# EAGLE schematic cdciom8print (EAGLE 7.7.0)
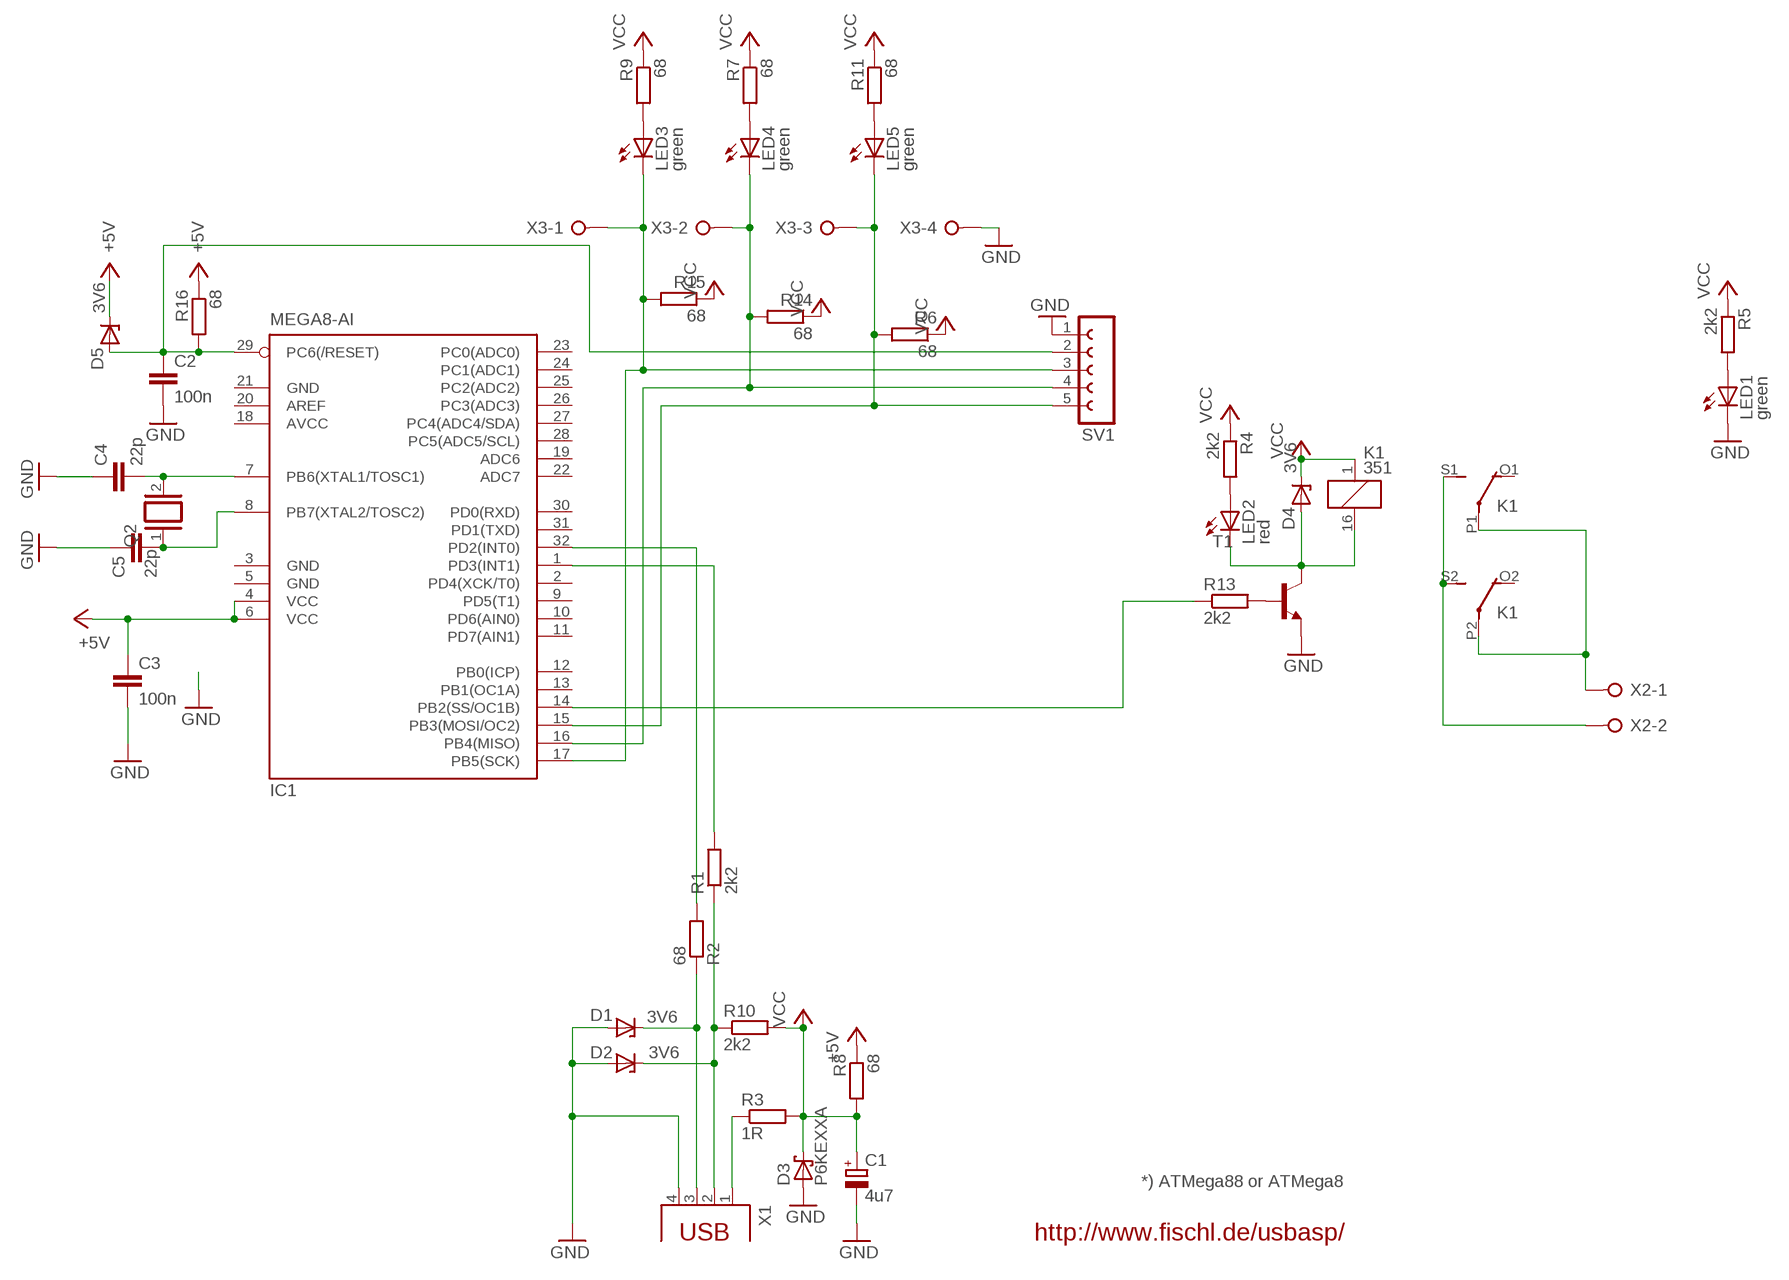
[diagram p0: schematic, sheet 1]

## Parts
C1  4u7  CPOL-EUE2.5-5  [E2,5-5]
C2  100n  C-EU025-024X044  [C025-024X044]
C3  100n  C-EU025-024X044  [C025-024X044]
C4  22p  C-EU025-024X044  [C025-024X044]
C5  22p  C-EU025-024X044  [C025-024X044]
D1  3V6  ZENER-DIODEDO34-7  [DO34Z7]
D2  3V6  ZENER-DIODEDO34-7  [DO34Z7]
D3  P6KEXXA  [C1702-15]
D4  3V6  ZENER-DIODEDO34-7  [DO34Z7]
D5  3V6  ZENER-DIODEDO34-7  [DO34Z7]
IC1  MEGA8-AI  [TQFP32-08]
K1  351  [351]
LED1  green  LED3MM  [LED3MM]
LED2  red  LED3MM  [LED3MM]
LED3  green  LED3MM  [LED3MM]
LED4  green  LED3MM  [LED3MM]
LED5  green  LED3MM  [LED3MM]
Q2  XTAL/S  [QS]
R1  2k2  R-EU_0207/2V  [0207/2V]
R2  68  R-EU_0207/10  [0207/10]
R3  1R  R-EU_0207/2V  [0207/2V]
R4  2k2  R-EU_0207/2V  [0207/2V]
R5  2k2  R-EU_0207/2V  [0207/2V]
R6  68  R-EU_0207/10  [0207/10]
R7  68  R-EU_0207/10  [0207/10]
R8  68  R-EU_0207/10  [0207/10]
R9  68  R-EU_0207/10  [0207/10]
R10  2k2  R-EU_0207/2V  [0207/2V]
R11  68  R-EU_0207/10  [0207/10]
R13  2k2  R-EU_0207/2V  [0207/2V]
R14  68  R-EU_0207/10  [0207/10]
R15  68  R-EU_0207/10  [0207/10]
R16  68  R-EU_0207/10  [0207/10]
SV1  FE05-1  [FE05-1]
T1  2N4124-NPN-TO92-CBE  [TO92-CBE]
X1  PN61729  [PN61729]
X2  W237-02P  [W237-132]
X3  W237-04P  [W237-4P]

## Nets
+5V: C3.1 D5.C IC1.4(VCC) IC1.6(VCC) R8.1 R16.1
GND: C1.- C2.2 C3.2 C4.1 C5.1 D1.A D2.A D3.A LED1.K(C) SV1.1 T1.E X1.4 X3.4
N$1: C2.1 D5.A IC1.29(PC6(/RESET)) R16.2 SV1.2
N$2: R13.2 T1.B
N$3: IC1.14(PB2(SS/OC1B)) R13.1
N$4: D4.A K1.16 LED2.K(C) T1.C
N$5: D2.C R1.1 R10.1 X1.2
N$6: K1.S1(2:S) K1.S2(3:S) X2.2
N$7: IC1.32(PD2(INT0)) R2.2
N$8: D1.C R2.1 X1.3
N$9: LED2.A R4.2
N$10: K1.P1(2:P) K1.P2(3:P) X2.1
N$11: R3.1 X1.1
N$12: LED1.A R5.2
N$13: LED3.A R9.2
N$14: LED4.A R7.2
N$15: LED5.A R11.2
N$16: IC1.1(PD3(INT1)) R1.2
N$17: IC1.17(PB5(SCK)) LED3.K(C) R15.2 SV1.3 X3.1
N$18: IC1.16(PB4(MISO)) LED4.K(C) R14.2 SV1.4 X3.2
N$19: IC1.15(PB3(MOSI/OC2)) LED5.K(C) R6.2 SV1.5 X3.3
N$22: C4.2 IC1.7(PB6(XTAL1/TOSC1)) Q2.2
N$23: C5.2 IC1.8(PB7(XTAL2/TOSC2)) Q2.1
VCC: C1.+ D3.C D4.C K1.1 R3.2 R4.1 R5.1 R6.1 R7.1 R8.2 R9.1 R10.2 R11.1 R14.1 R15.1
Unconnected: IC1.2(PD4(XCK/T0)) IC1.9(PD5(T1)) IC1.10(PD6(AIN0)) IC1.11(PD7(AIN1)) IC1.12(PB0(ICP)) IC1.13(PB1(OC1A)) IC1.19(ADC6) IC1.20(AREF) IC1.22(ADC7) IC1.23(PC0(ADC0)) IC1.24(PC1(ADC1)) IC1.25(PC2(ADC2)) IC1.26(PC3(ADC3)) IC1.27(PC4(ADC4/SDA)) IC1.28(PC5(ADC5/SCL)) IC1.30(PD0(RXD)) IC1.31(PD1(TXD)) K1.O1(2:O) K1.O2(3:O)

## Notes on the sheet
- *) ATMega88 or ATMega8
- http://www.fischl.de/usbasp/

## Power pins joined to a net without a drawn wire
AVCC: IC1.18(AVCC)
GND: IC1.3(GND) IC1.5(GND) IC1.21(GND)

## Library data of the parts
C1 = rcl:CPOL-EU: POLARIZED CAPACITOR, European symbol
C2-C5 = rcl:C-EU: CAPACITOR, European symbol
D1 D2 D4 D5 = diode:ZENER-DIODE: Z-Diode
D3 = diode:P6KEXXA: DIODE transient-voltage suppressor
IC1 = atmel:MEGA8: MICROCONTROLLER 8 Kbytes FLASH, 1 kbytes SRAM, 512 bytes EEPROM, USART, 6-channel 10 bit ADC, 2-channel 8 bit ADC Pin compatible with Atmega48, ATMega88, ATMega168 Source: avr.lbr; MPN: ATMEGA8-16AU; OC_FARNELL: 9171371; OC_NEWARK: 73M8863
K1 = relay:351: RELAY 2 x switch, Omron; OC_FARNELL: unknown; OC_NEWARK: unknown
LED1-LED5 = led:LED: LED OSRAM: - CHIPLED LG R971, LG N971, LY N971, LG Q971, LY Q971, LO R971, LY R971 LH N974, LH R974 LS Q976, LO Q976, LY Q976 LO Q996 - Hyper CHIPLED LW Q18S LB Q993, LB Q99A, LB R99A - SideLED LS A670, LO A670, LY A670, LG A670, LP A670 LB A673, LV A673, LT A673, LW A673 LH A674 LY A675 LS A676, LA A676, LO A676, LY A676, LW A676 LS A679, LY A679, LG A679 - Hyper Micro SIDELED® LS Y876, LA Y876, LO Y876, LY Y876 LT Y87S - SmartLED LW L88C, LW L88S LB L89C, LB L89S, LG L890 LS L89K, LO L89K, LY L89K LS L896, LA L896, LO L896, LY L896 - TOPLED LS T670, LO T670, LY T670, LG T670, LP T670 LSG T670, LSP T670, LSY T670, LOP T670, LYG T670 LG T671, LOG T671, LSG T671 LB T673, LV T673, LT T673, LW T673 LH T674 LS T676, LA T676, LO T676, LY T676, LB T676, LH T676, LSB T676, LW T676 LB T67C, LV T67C, LT T67C, LS T67K, LO T67K, LY T67K, LW E67C LS E67B, LA E67B, LO E67B, LY E67B, LB E67C, LV E67C, LT E67C LW T67C LS T679, LY T679, LG T679 LS T770, LO T770, LY T770, LG T770, LP T770 LB T773, LV T773, LT T773, LW T773 LH T774 LS E675, LA E675, LY E675, LS T675 LS T776, LA T776, LO T776, LY T776, LB T776 LHGB T686 LT T68C, LB T68C - Hyper Mini TOPLED® LB M676 - Mini TOPLED Santana® LG M470 LS M47K, LO M47K, LY M47K Source: http://www.osram.convergy.de/
Q2 = special:XTAL/S: CRYSTAL
R1-R11 R13-R16 = rcl:R-EU_: RESISTOR, European symbol
SV1 = con-lsta:FE05-1: FEMALE HEADER; OC_FARNELL: unknown; OC_NEWARK: unknown
T1 = transistor:*-NPN-: NPN Transistror BF959 corrected 2008.03.06
X1 = con-berg:PN61729: BERG USB connector
X2 = con-wago-508:W237-02P: WAGO SREW CLAMP; OC_FARNELL: unknown; OC_NEWARK: unknown
X3 = con-wago-508:W237-04P: WAGO SREW CLAMP; OC_FARNELL: unknown; OC_NEWARK: unknown